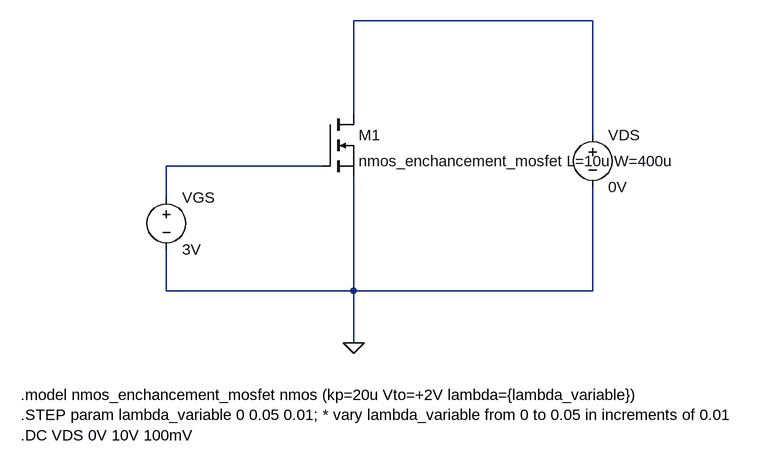
[diagram p0: schematic MosfetCharacteristic.asc]
MosfetCharacteristic.asc, the LTspice schematic file:
Version 4.1
SHEET 1 960 680
WIRE 640 -48 272 -48
WIRE 272 96 272 -48
WIRE 640 128 640 -48
WIRE 224 176 -16 176
WIRE -16 224 -16 176
WIRE -16 368 -16 304
WIRE 272 368 272 192
WIRE 272 368 -16 368
WIRE 640 368 640 208
WIRE 640 368 272 368
WIRE 272 448 272 368
FLAG 272 448 0
SYMBOL nmos 224 96 R0
SYMATTR InstName M1
SYMATTR Value nmos_enchancement_mosfet L=10u W=400u
SYMBOL voltage -16 208 R0
SYMATTR InstName VGS
SYMATTR Value 3V
SYMBOL voltage 640 112 R0
SYMATTR InstName VDS
SYMATTR Value 0V
TEXT -240 528 Left 2 !.model nmos_enchancement_mosfet nmos (kp=20u Vto=+2V lambda={lambda_variable})\n.STEP param lambda_variable 0 0.05 0.01; * vary lambda_variable from 0 to 0.05 in increments of 0.01\n.DC VDS 0V 10V 100mV

The netlist it stands for:
* MosfetCharacteristic.asc
M1 N001 N002 0 0 nmos_enchancement_mosfet L=10u W=400u
VGS N002 0 3V
VDS N001 0 0V
.model NMOS NMOS
.model PMOS PMOS
.lib standard.mos
.model nmos_enchancement_mosfet nmos (kp=20u Vto=+2V lambda={lambda_variable})
.STEP param lambda_variable 0 0.05 0.01; * vary lambda_variable from 0 to 0.05 in increments of 0.01
.DC VDS 0V 10V 100mV
.backanno
.end